# Altium schematic sheet Akustikk_forsterkerkrets_v2.SchDoc: AAC9000
size A3; Author: Vegard Haraldstad; CompanyName: VORTEX NTNU; DrawnBy: Vegard Haraldstad; Revision: 1.0; SheetNumber: 1; SheetTotal: 1
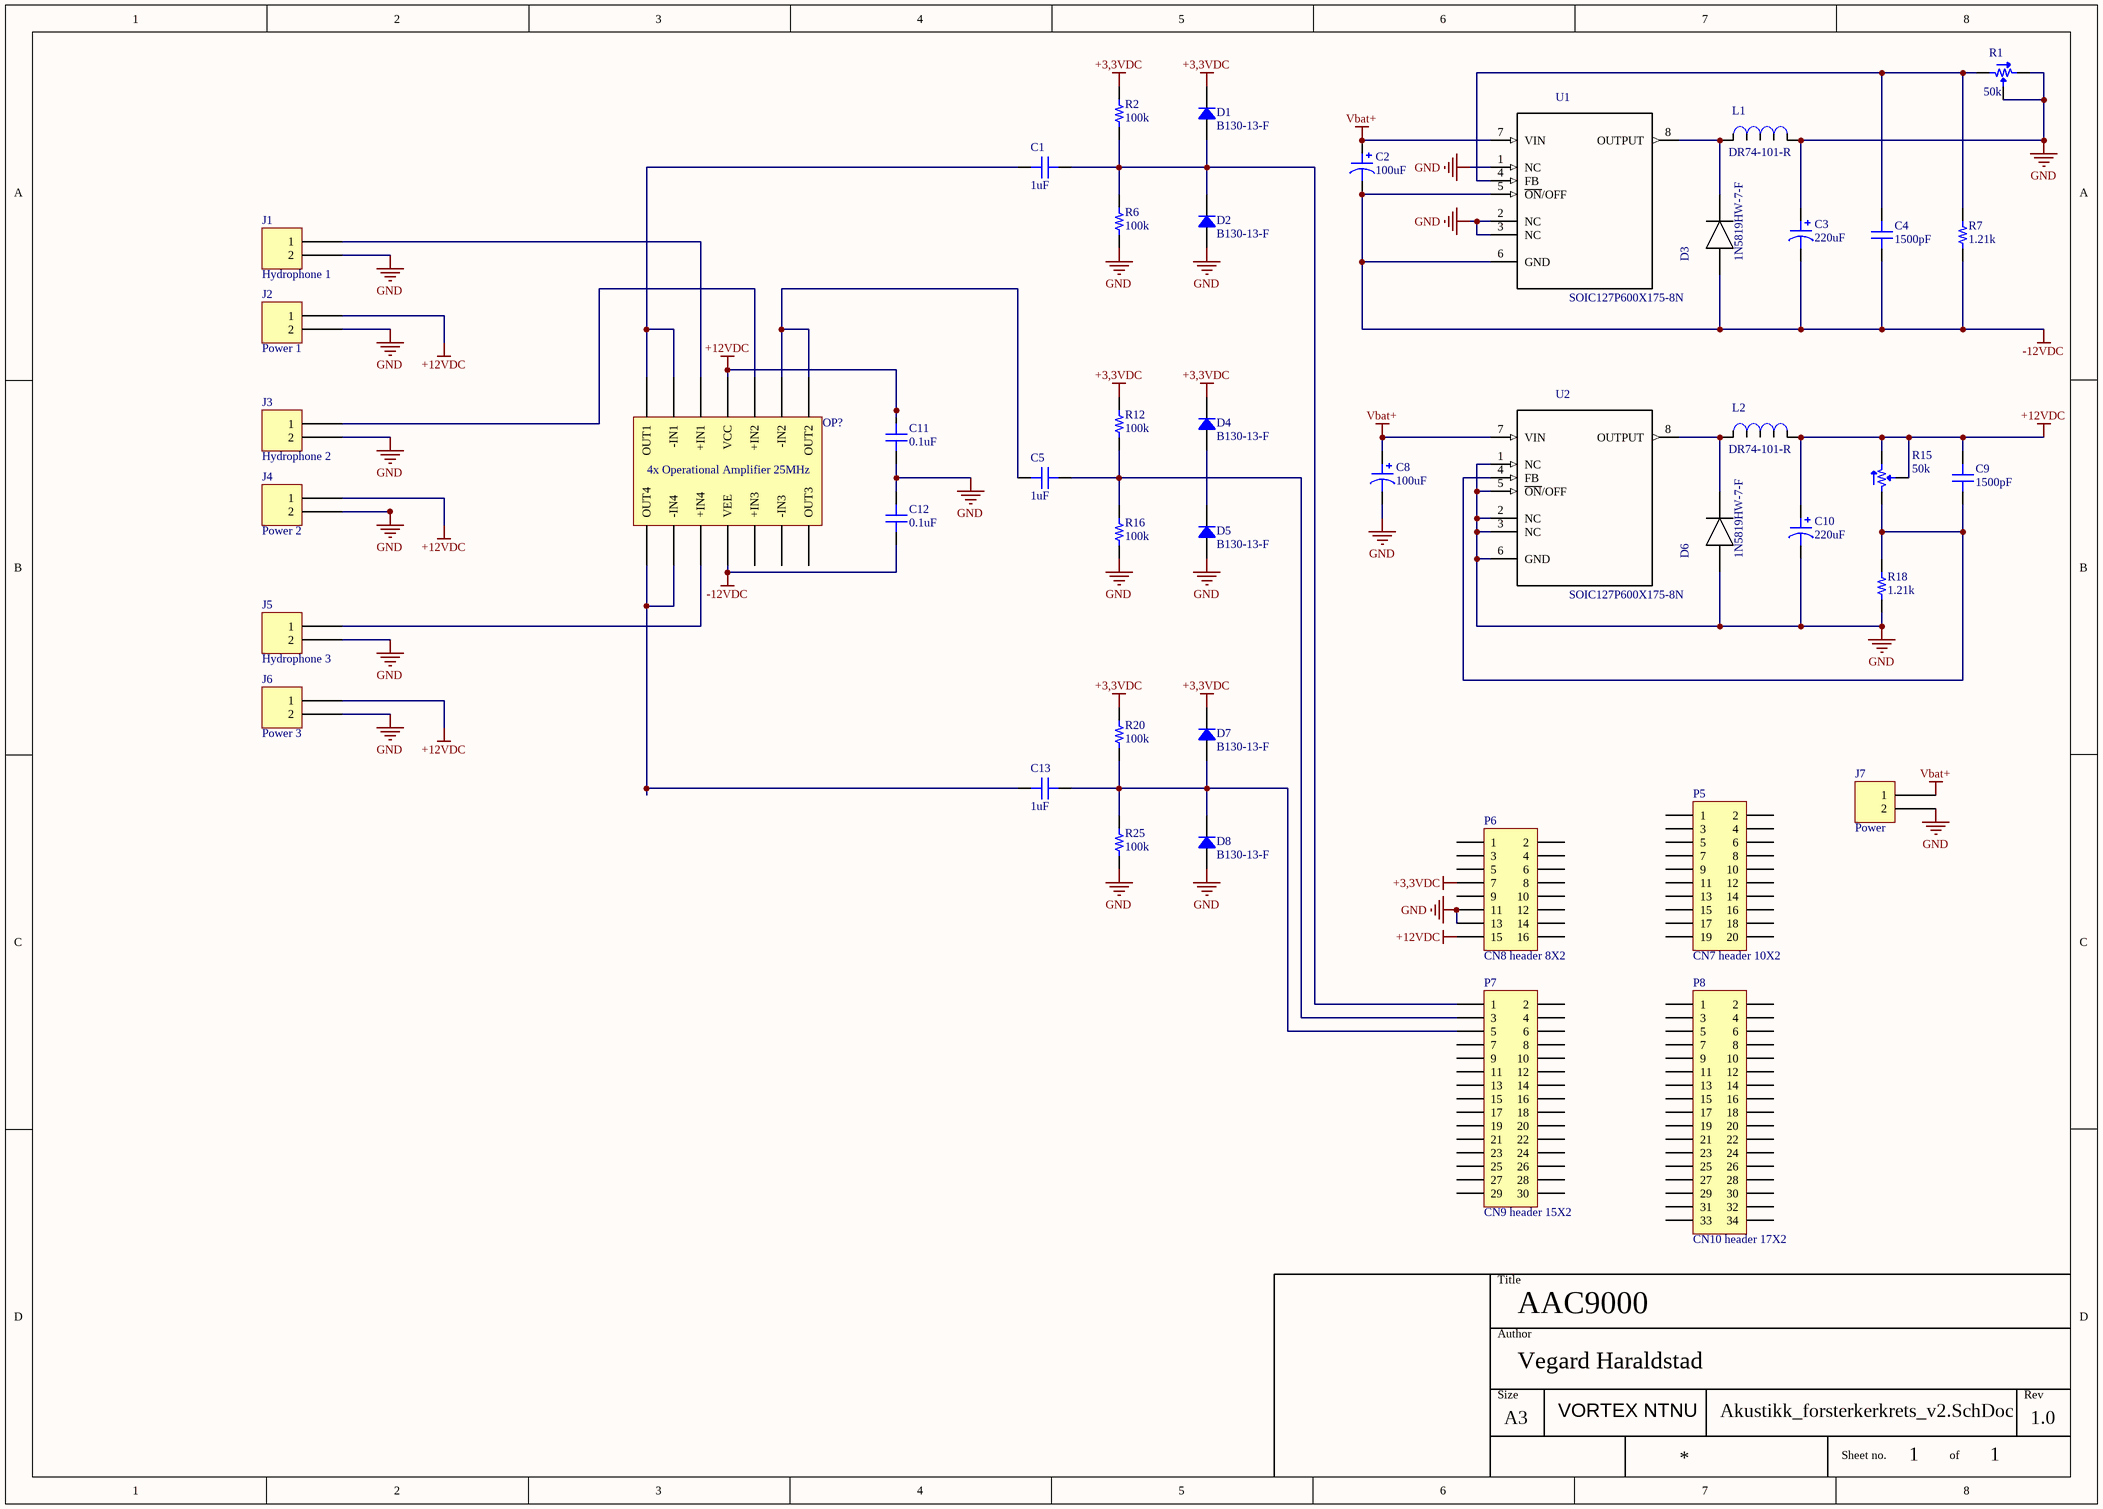
[diagram p0: Akustikk_forsterkerkrets_v2.SchDoc]

## Parts
C1  1uF  [CAP 0805/2012]
C2  100uF  [CAP ALUM 10.3MM]
C3  220uF  [CAP ALUM 6.6MM]
C4  1500pF  [CAP 0805/2012]
C5  1uF  [CAP 0805/2012]
C8  100uF  [CAP ALUM 10.3MM]
C9  1500pF  [CAP 0805/2012]
C10  220uF  [CAP ALUM 6.6MM]
C11  0.1uF  [CAP 0805/2012]
C12  0.1uF  [CAP 0805/2012]
C13  1uF  [CAP 0805/2012]
D1  B130-13-F  [DO214AC SMA]
D2  B130-13-F  [DO214AC SMA]
D3  1N5819HW-7-F  [1N5819HW-7-F]
D4  B130-13-F  [DO214AC SMA]
D5  B130-13-F  [DO214AC SMA]
D6  1N5819HW-7-F  [1N5819HW-7-F]
D7  B130-13-F  [DO214AC SMA]
D8  B130-13-F  [DO214AC SMA]
J1  Hydrophone 1  [JST XH B2B-XH-A]
J2  Power 1  [JST XH B2B-XH-A]
J3  Hydrophone 2  [JST XH B2B-XH-A]
J4  Power 2  [JST XH B2B-XH-A]
J5  Hydrophone 3  [JST XH B2B-XH-A]
J6  Power 3  [JST XH B2B-XH-A]
J7  Power  [JST XH B2B-XH-A]
L1  DR74-101-R  [DR74-101-R]
L2  DR74-101-R  [DR74-101-R]
OP?  4x Operational Amplifier 25MHz  [SOIC127P600X175-14N]
P5  CN7 header 10X2  [HDR2X10]
P6  CN8 header 8X2  [HDR2X8]
P7  CN9 header 15X2  [HDR2X15]
P8  CN10 header 17X2  [HDR2X17]
R1  50k  [POT BOURNS TRIMPOT 3302]
R2  100k  [RES 0805/2012]
R6  100k  [RES 0805/2012]
R7  1.21k  [RES 0805/2012]
R12  100k  [RES 0805/2012]
R15  50k  [POT BOURNS TRIMPOT 3302]
R16  100k  [RES 0805/2012]
R18  1.21k  [RES 0805/2012]
R20  100k  [RES 0805/2012]
R25  100k  [RES 0805/2012]
U1  SOIC127P600X175-8N  [SOIC127P600X175-8N]
U2  SOIC127P600X175-8N  [SOIC127P600X175-8N]

## Nets
+3,3VDC: D1.2 D4.2 D7.2 P6.7 R2.2 R12.2 R20.2
+12VDC: C9.2 C10.1 C11.2 J2.1 J4.1 J6.1 L2.1 OP?.4(VCC) P6.15 R15.2 R15.3
-12VDC: C2.2 C3.2 C4.1 C12.1 D3.2(A) OP?.11(VEE) R7.1 U1.5(~{ON}/OFF) U1.6(GND)
GND: C3.1 C8.2 C10.2 C11.1 C12.2 D2.1 D5.1 D6.2(A) D8.1 J1.2 J2.2 J3.2 J4.2 J5.2 J6.2 J7.2 L1.1 P6.11 P6.13 R1.2 R1.3 R6.1 R16.1 R18.1 R25.1 U1.1(NC) U1.2(NC) U1.3(NC) U2.1(NC) U2.2(NC) U2.3(NC) U2.5(~{ON}/OFF) U2.6(GND)
Vbat+: C2.1 C8.1 J7.1 U1.7(VIN) U2.7(VIN)
NetC1_1: C1.1 OP?.1(OUT1) OP?.2(-IN1)
NetC1_2: C1.2 D1.1 D2.2 P7.1 R2.1 R6.2
NetC4_2: C4.2 R1.1 R7.2 U1.4(FB)
NetC5_1: C5.1 OP?.6(-IN2) OP?.7(OUT2)
NetC5_2: C5.2 P7.3 R12.1 R16.2
NetC9_1: C9.1 R15.1 R18.2 U2.4(FB)
NetC13_1: C13.1 OP?.8(OUT4) OP?.9(-IN4)
NetC13_2: C13.2 D7.1 D8.2 P7.5 R20.1 R25.2
NetD3_1: D3.1(C) L1.2 U1.8(OUTPUT)
NetD4_1: D4.1 D5.2
NetD6_1: D6.1(C) L2.2 U2.8(OUTPUT)
NetJ1_1: J1.1 OP?.3(+IN1)
NetJ3_1: J3.1 OP?.5(+IN2)
NetJ5_1: J5.1 OP?.10(+IN4)

Not connected (* = marked no-connect by the designer): OP? 12(+IN3) 13(-IN3) 14(OUT3); P5 1 2 3 4 5 6 7 8 9 10 11 12 13 14 15 16 17 18 19 20; P6 1 2 3 4 5 6 8 9 10 12 14 16; P7 2 4 6 7 8 9 10 11 12 13 14 15 16 17 18 19 20 21 22 23 24 25 26 27 28 29 30; P8 1 2 3 4 5 6 7 8 9 10 11 12 13 14 15 16 17 18 19 20 21 22 23 24 25 26 27 28 29 30 31 32 33 34

## Notes on the sheet
- Title
- Size
- Author
- Rev
- A3
- Sheet no.
- of

## Library data of the parts
C1 C5 C13 = C0805C105J3RACTU: CAP CER 1UF 25V X7R 0805; Manufacturer: Kemet; TemperatureRange: -55C ~ 125C; Tolerance: 5%; Value: 1uF; Part Number: C0805C105J3RACTU; PartId: 6145; Supplier 1: Digi-Key; Supplier Part Number 1: 399-10060-2-ND; ComponentLink1Description: Datasheet; ComponentLink1URL: http://www.kemet.com/docfinder?Partnumber=C0805C105J3RACTU; ComponentLink2Description: Digi-Key listing; ComponentLink2URL: http://digikey.com/product-detail/en/C0805C105J3RACTU/399-10060-2-ND/2211758; TemperatureCoefficient: X7R; Voltage: 25V; Price: 0,355; Type: -; Device Package: 0805 (2012 Metric)
C2 C8 = EEE-FC1H101P: CAP ALUM 100UF 20% 50V SMD; Manufacturer: Panasonic Electronic Components; TemperatureRange: -40C ~ 105C; Type: AEC-Q200; Ripple Current: 375mA; Impedance: 300 mOhm; Lifetime @ Temp: 1000 Hrs @ 105C; Value: 100uF; Part Number: EEE-FC1H101P; PartId: 7438; Supplier 1: Digi-Key; Supplier Part Number 1: PCE4013TR-ND; ComponentLink1Description: Datasheet; ComponentLink1URL: http://industrial.panasonic.com/www-cgi/jvcr13pz.cgi?E+PZ+3+ABA0005+EEEFC1H101P+7+WW; ComponentLink2Description: Digi-Key listing; ComponentLink2URL: http://digikey.com/product-detail/en/EEE-FC1H101P/PCE4013TR-ND/817422; Tolerance: 20%; Voltage: 50V; Price: 0,4156; Device Package: Radial, Can - SMD
C3 C10 = EEE-FTE221XAP: CAP ALUM 220UF 20% 25V SMD; Manufacturer: Panasonic Electronic Components; TemperatureRange: -55C ~ 105C; Type: Automotive; Ripple Current: 390mA; Lifetime @ Temp: 2000 Hrs @ 105C; Value: 220uF; Part Number: EEE-FTE221XAP; PartId: 7275; Supplier 1: Digi-Key; Supplier Part Number 1: PCE5009TR-ND; ComponentLink1Description: Datasheet; ComponentLink1URL: http://industrial.panasonic.com/lecs/www-data/pdf/ABA0000/ABA0000CE135.pdf; ComponentLink2Description: Digi-Key listing; ComponentLink2URL: http://digikey.com/product-detail/en/EEE-FTE221XAP/PCE5009TR-ND/2652040; Tolerance: 20%; Voltage: 25V; Price: 0,3668; Device Package: Radial, Can - SMD; Impedance: -
C4 C9 = C2012C0G1H152J060AA: CAP CER 1500PF 50V C0G 0805; Manufacturer: TDK Corporation; TemperatureRange: -55C ~ 125C; TemperatureCoefficient: C0G, NP0; Tolerance: 5%; Value: 1500pF; Part Number: C2012C0G1H152J060AA; PartId: 4413; Supplier 1: Digi-Key; Supplier Part Number 1: 445-1331-2-ND; ComponentLink1Description: Datasheet; ComponentLink1URL: https://product.tdk.com/info/en/catalog/datasheets/mlcc_commercial_general_en.pdf; ComponentLink2Description: Digi-Key listing; ComponentLink2URL: http://digikey.com/product-detail/en/C2012C0G1H152J060AA/445-1331-2-ND/513857; Voltage: 50V; Price: 0,0308; Type: -; Device Package: 0805 (2012 Metric)
C11 C12 = CL21B104KACNNNC: CAP CER 0.1UF 25V X7R 0805; Manufacturer: Samsung Electro-Mechanics America, Inc.; TemperatureRange: -55C ~ 125C; Tolerance: 10%; Value: 0.1uF; Part Number: CL21B104KACNNNC; PartId: 5699; Supplier 1: Digi-Key; Supplier Part Number 1: 1276-1099-2-ND; ComponentLink1Description: Datasheet; ComponentLink1URL: http://www.samsungsem.com/kr/support/product-search/mlcc/CL21B104KACNNNC.jsp; ComponentLink2Description: Digi-Key listing; ComponentLink2URL: http://digikey.com/product-detail/en/CL21B104KACNNNC/1276-1099-2-ND/3886757; TemperatureCoefficient: X7R; Voltage: 25V; Price: 0,0099; Type: -; Device Package: 0805 (2012 Metric)
D1 D2 D4 D5 D7 D8 = B130-13-F: DIODE SCHOTTKY 30V 1A SMA; Manufacturer: Diodes Incorporated; Type: Surface Mount; Current Reverse Leakage @ Vr: 500uA @ 30V; Voltage Forward (Vf): 500mV @ 1A; Part Number: B130-13-F; PartId: 7122; Supplier 1: Digi-Key; Supplier Part Number 1: B130-FDITR-ND; ComponentLink1Description: Datasheet; ComponentLink1URL: http://www.diodes.com/_files/datasheets/ds13002.pdf; ComponentLink2Description: Digi-Key Listing; ComponentLink2URL: http://www.digikey.ca/product-detail/en/B130-13-F/B130-FDITR-ND/814935; Junction Operating Temperature: -65C ~ 150C; Price: 0,0852; Device Package: DO-214AC, SMA; Reverse Recovery Time (trr): -; Voltage DC Reverse (Vr): 30V; Current Rectified: 1A
D3 D6 = 1N5819HW-7-F: 1N5819HW Series 40 V 1 A Surface Mount Schottky Barrier Rectifier - SOD-123; MF: Diodes Inc.; SnapEDA_Link: https://www.snapeda.com/parts/1N5819HW-7-F/Diodes%20Inc./view-part/?ref=snap; Digi-Key_Part_Number: 1N5819HW-FDICT-ND; Digi-Key_Purchase_URL: https://www.digikey.no/product-detail/en/diodes-incorporated/1N5819HW-7-F/1N5819HW-FDICT-ND/815283?utm_source=snapeda&utm_medium=aggregator&utm_campaign=symbol; MP: 1N5819HW-7-F; Package: SOD-123 Diodes Inc.; Value: *; Part Number: 1N5819HW-7-F; ComponentLink1Description: Manufacturer Link; ComponentLink1URL: https://www.digikey.no/en/supplier-centers/d/diodes; ComponentLink2Description: Datasheet; ComponentLink2URL: https://www.diodes.com/assets/Datasheets/ds30217.pdf; Supplier 1: Digi-Key; Supplier Part Number 1: 1N5819HW-FDICT-ND
J1-J7 = B2B-XH-A(LF)(SN): CONN HEADER XH TOP 2POS 2.5MM; Manufacturer: JST Sales America Inc.; Pitch: 0.098" (2.50mm); Number Of Positions: 2; Part Number: B2B-XH-A(LF)(SN); Colour: Natural; PartId: 16449; Supplier 1: Digi-Key; Supplier Part Number 1: 455-2247-ND; ComponentLink1Description: Datasheet; ComponentLink1URL: http://www.jst-mfg.com/product/pdf/eng/eXH.pdf; ComponentLink2Description: Digi-Key Listing; ComponentLink2URL: http://www.digikey.com/product-detail/en/jst-sales-america-inc/B2B-XH-A(LF)(SN)/455-2247-ND/1651045; Price: 0,15; Type: Header, Shrouded; Contact Finish: Tin; Fastening Type: Detent Lock; Number Of Rows: 1; Series: XH
L1 L2 = DR74-101-R: Inductor Power Shielded Drum Core 101.6uH/100uH 20% 100KHz Ferrite 860mA 383mOhm DCR T/R; MF: Eaton; Value: 100 μH; SnapEDA_Link: https://www.snapeda.com/parts/DR74-101-R/Eaton/view-part/?ref=snap; Availability: Unavailable; MP: DR74-101-R; Price: None; Package: Nonstandard Eaton; Part Number: DR74-101-R; ComponentLink1Description: Manufacturer Link; ComponentLink1URL: https://www.digikey.no/en/supplier-centers/e/eaton; ComponentLink2Description: Datasheet; ComponentLink2URL: https://www.eaton.com/content/dam/eaton/products/electronic-components/resources/data-sheet/eaton-dr-high-power-density-high-efficiency-shielded-drum-core-power-inductors-data-sheet.pdf; Supplier 1: Digi-Key; Supplier Part Number 1: 513-1225-1-ND; Irms: 860mA
OP? = LM837MX/NOPB: Part Number: LM837MX/NOPB; ComponentLink1Description: Manufacturer Link; ComponentLink1URL: http://www.ti.com/; ComponentLink2Description: Datasheet; ComponentLink2URL: http://www.ti.com/lit/ds/symlink/lm837.pdf; Supplier 1: Digi-Key; Supplier Part Number 1: 296-43966-1-ND
P5 = Header 10X2: Header, 10-Pin, Dual row; LatestRevisionDate: 17-Jul-2002; LatestRevisionNote: Re-released for DXP Platform.; Publisher: Altium Limited
P6 = Header 8X2: Header, 8-Pin, Dual row; LatestRevisionDate: 17-Jul-2002; LatestRevisionNote: Re-released for DXP Platform.; Publisher: Altium Limited
P7 = Header 15X2: Header, 15-Pin, Dual row; LatestRevisionDate: 17-Jul-2002; LatestRevisionNote: Re-released for DXP Platform.; Publisher: Altium Limited
P8 = Header 17X2: Header, 17-Pin, Dual row; LatestRevisionDate: 17-Jul-2002; LatestRevisionNote: Re-released for DXP Platform.; Publisher: Altium Limited
R1 R15 = 3302W-3-203E: TRIMMER 20K OHM 0.15W SMD; Manufacturer: Bourns Inc.; TemperatureCoefficient: 250ppm/C; Tolerance: 25%; Number Of Turns: 1; Adjustment Type: Top Adjustment; Value: 50k; Part Number: 3302W-3-203E; PartId: 29442; Supplier 1: Digi-Key; Supplier Part Number 1: 3302W-203ECT-ND; ComponentLink1Description: Datasheet; ComponentLink1URL: http://www.bourns.com/docs/Product-Datasheets/3302.pdf; ComponentLink2Description: Digi-Key Listing; ComponentLink2URL: https://www.digikey.com/product-detail/en/bourns-inc/3302W-3-203E/3302W-203ECT-ND/612878; PowerRating: 0.15W; Price: 0,97
R2 R6 R12 R16 R20 R25 = ERJ-6GEYJ104V: RES SMD 100K OHM 5% 1/8W 0805; Manufacturer: Panasonic Electronic Components; TemperatureRange: -55C ~ 155C; TemperatureCoefficient: 200ppm/C; PowerRating: 0.125W, 1/8W; Value: 100k; Part Number: ERJ-6GEYJ104V; PartId: 11445; Supplier 1: Digi-Key; Supplier Part Number 1: P100KATR-ND; ComponentLink1Description: Datasheet; ComponentLink1URL: http://industrial.panasonic.com/www-cgi/jvcr13pz.cgi?E+PZ+3+AOA0001+ERJ6GEYJ104V+7+WW; ComponentLink2Description: Digi-Key Listing; ComponentLink2URL: https://www.digikey.com/product-detail/en/panasonic-electronic-components/ERJ-6GEYJ104V/P100KATR-ND/83110; Tolerance: 5%; Price: 0,0032; Device Package: 0805 (2012 Metric)
R7 R18 = ERA-6AEB1211V: RES SMD 1.21K OHM 0.1% 1/8W 0805; Manufacturer: Panasonic Electronic Components; TemperatureRange: -55C ~ 155C; TemperatureCoefficient: 25ppm/C; PowerRating: 0.125W, 1/8W; Value: 1.21k; Part Number: ERA-6AEB1211V; PartId: 2672; Supplier 1: Digi-Key; Supplier Part Number 1: P1.21KDATR-ND; ComponentLink1Description: Datasheet; ComponentLink1URL: http://industrial.panasonic.com/lecs/www-data/pdf/AOA0000/AOA0000CE26.pdf; ComponentLink2Description: Digi-Key listing; ComponentLink2URL: http://digikey.com/product-detail/en/ERA-6AEB1211V/P1.21KDATR-ND/2025670; Tolerance: 0.1%; Price: 0,0653; Type: Thin Film; Device Package: 0805 (2012 Metric)
U1 U2 = SOIC127P600X175-8N: SIMPLE SWITCHERÂ® 40V, 500mA Low Component Count Step-Down Regulator 8-SOIC -40 to 125; MP: LM2674MX-12/NOPB; MF: Texas Instruments; Vin,min: 4.5V; Vout,min: 1.23V; Vout,max: 37V; SnapEDA_Link: https://www.snapeda.com/parts/LM2674MX-12/NOPB/Texas%20Instruments/view-part/?ref=snap; Availability: Unavailable; Package: SOIC-8 Texas Instruments; Price: None; Value: *; Part Number: SOIC127P600X175-8N; ComponentLink1Description: Manufacturer Link; ComponentLink1URL: https://www.digikey.com/en/supplier-centers/o/on-semiconductor; ComponentLink2Description: Datasheet; ComponentLink2URL: ww.onsemi.com/pub/Collateral/LM2594-D.PDF; Supplier 1: Digi-Key; Supplier Part Number 1: LM2594DADJR2GOSCT-ND; Vin,max: 40V; Iout,max: 500mA